# EAGLE design DoomBoxMk1 (EAGLE 9.6.2)
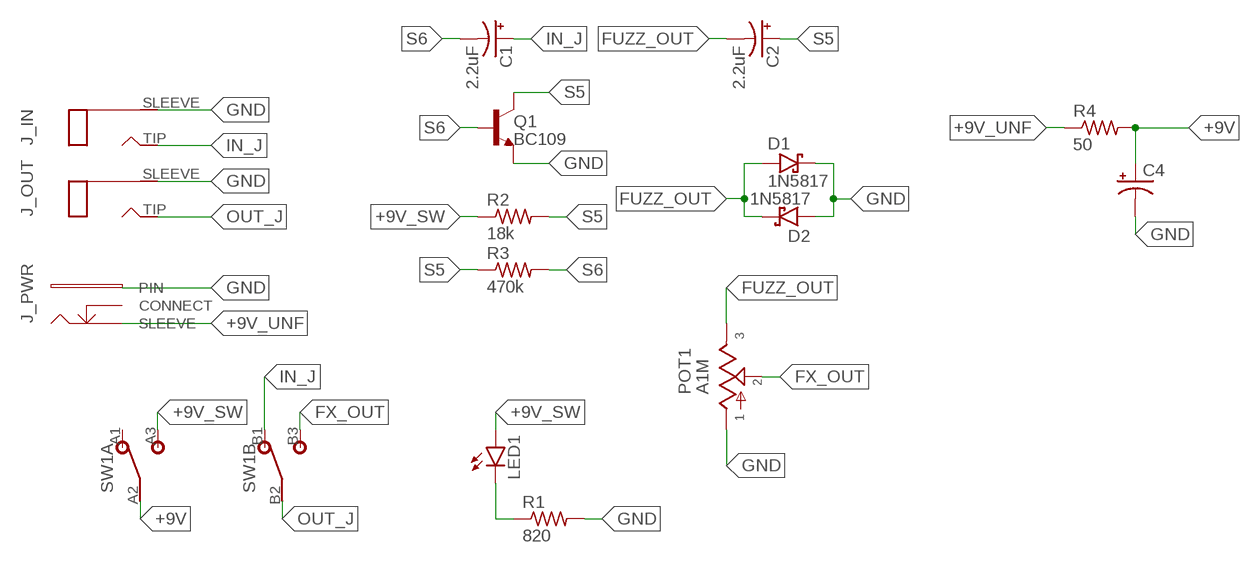
[diagram p0: schematic, sheet 1]

## Parts
C1  2.2uF  0501  [050_020_1]
C2  2.2uF  0501  [050_020_1]
C4  0802  [080_035_2]
D1  1N5817  [DO41-3]
D2  1N5817  [DO41-3]
J_IN  MONO  [MONO_JACK]
J_OUT  MONO  [MONO_JACK]
J_PWR  DC  [DC_POWER_JACK]
LED1  LED5MM  [LED5MM]
POT1  A1M  POTS  [16MM-SQUARE]
Q1  BC109  [TO92-]
R1  820  6MM.3  [R0207/3]
R2  18k  6MM.3  [R0207/3]
R3  470k  6MM.3  [R0207/3]
R4  50  6MM.3  [R0207/3]
SW1  DPDT  [DPDT]

## Nets
+9V: C4.+ R4.2 SW1.A2
+9V_SW: LED1.A R2.1 SW1.A3
+9V_UNF: J_PWR.SLEEVE R4.1
FUZZ_OUT: C2.- D1.A D2.C POT1.3
FX_OUT: POT1.2 SW1.B3
GND: C4.- D1.C D2.A J_IN.SLEEVE J_OUT.SLEEVE J_PWR.PIN POT1.1 Q1.1(E) R1.2
IN_J: C1.+ J_IN.TIP SW1.B1
N$2: LED1.K(C) R1.1
OUT_J: J_OUT.TIP SW1.B2
S5: C2.+ Q1.3(C) R2.2 R3.1
S6: C1.- Q1.2(B) R3.2
Unconnected: J_PWR.CLOSE(CONNECT) SW1.A1

## Library data of the parts
C1 C2 = gm-caps-electro-pol:050: 0.22 - 100uF Xicon values at Mouser.com: 10V: 10 - 100uF; 16V: 2.2 - 47uF; 25V: 0.47 - 47uF; 50V: 0.22 - 22uF
C4 = gm-caps-electro-pol:080: 47 - 470uF Xicon values at Mouser.com 10V: 330, 470uF; 16V: 220, 330uF; 25V: 220uF; 50V: 47, 100uF
D1 D2 = gm-diodes:1N5817
J_IN J_OUT = gm-jacks:MONO: Mono 1/4" Phone Jack
J_PWR = gm-jacks:DC: DC Jack
LED1 = led:LED: LED OSRAM: - CHIPLED LG R971, LG N971, LY N971, LG Q971, LY Q971, LO R971, LY R971 LH N974, LH R974 LS Q976, LO Q976, LY Q976 LO Q996 - Hyper CHIPLED LW Q18S LB Q993, LB Q99A, LB R99A - SideLED LS A670, LO A670, LY A670, LG A670, LP A670 LB A673, LV A673, LT A673, LW A673 LH A674 LY A675 LS A676, LA A676, LO A676, LY A676, LW A676 LS A679, LY A679, LG A679 - Hyper Micro SIDELED® LS Y876, LA Y876, LO Y876, LY Y876 LT Y87S - SmartLED LW L88C, LW L88S LB L89C, LB L89S, LG L890 LS L89K, LO L89K, LY L89K LS L896, LA L896, LO L896, LY L896 - TOPLED LS T670, LO T670, LY T670, LG T670, LP T670 LSG T670, LSP T670, LSY T670, LOP T670, LYG T670 LG T671, LOG T671, LSG T671 LB T673, LV T673, LT T673, LW T673 LH T674 LS T676, LA T676, LO T676, LY T676, LB T676, LH T676, LSB T676, LW T676 LB T67C, LV T67C, LT T67C, LS T67K, LO T67K, LY T67K, LW E67C LS E67B, LA E67B, LO E67B, LY E67B, LB E67C, LV E67C, LT E67C LW T67C LS T679, LY T679, LG T679 LS T770, LO T770, LY T770, LG T770, LP T770 LB T773, LV T773, LT T773, LW T773 LH T774 LS E675, LA E675, LY E675, LS T675 LS T776, LA T776, LO T776, LY T776, LB T776 LHGB T686 LT T68C, LB T68C - Hyper Mini TOPLED® LB M676 - Mini TOPLED Santana® LG M470 LS M47K, LO M47K, LY M47K Source: http://www.osram.convergy.de LUXEON: - LUMILED® LXK2-PW12-R00, LXK2-PW12-S00, LXK2-PW14-U00, LXK2-PW14-V00 LXK2-PM12-R00, LXK2-PM12-S00, LXK2-PM14-U00 LXK2-PE12-Q00, LXK2-PE12-R00, LXK2-PE12-S00, LXK2-PE14-T00, LXK2-PE14-U00 LXK2-PB12-K00, LXK2-PB12-L00, LXK2-PB12-M00, LXK2-PB14-N00, LXK2-PB14-P00, LXK2-PB14-Q00 LXK2-PR12-L00, LXK2-PR12-M00, LXK2-PR14-Q00, LXK2-PR14-R00 LXK2-PD12-Q00, LXK2-PD12-R00, LXK2-PD12-S00 LXK2-PH12-R00, LXK2-PH12-S00 LXK2-PL12-P00, LXK2-PL12-Q00, LXK2-PL12-R00 Source: www.luxeon.com KINGBRIGHT: KA-3528ASYC Source: www.kingbright.com
POT1 = gm-pots:POT: Potentiometers the arrow indicates the clockwise motion of th wiper (lug 2) fully counter clockwise there is no resistance between lugs 1 and 2 fully clockwise the resistance between lugs 1 and 2 is the value of the pot
Q1 = mb_trans:BC109
R1-R4 = gm-resistors:6MM: 6mm Resistors Leads spaced 1-6 holes apart for 0.1" perfboard. Suitable for 1/4 watt resistors.
SW1 = gm-switches:DPDT

## Net classes
0 default: width 0.61 mm, clearance 0.61 mm

## Board
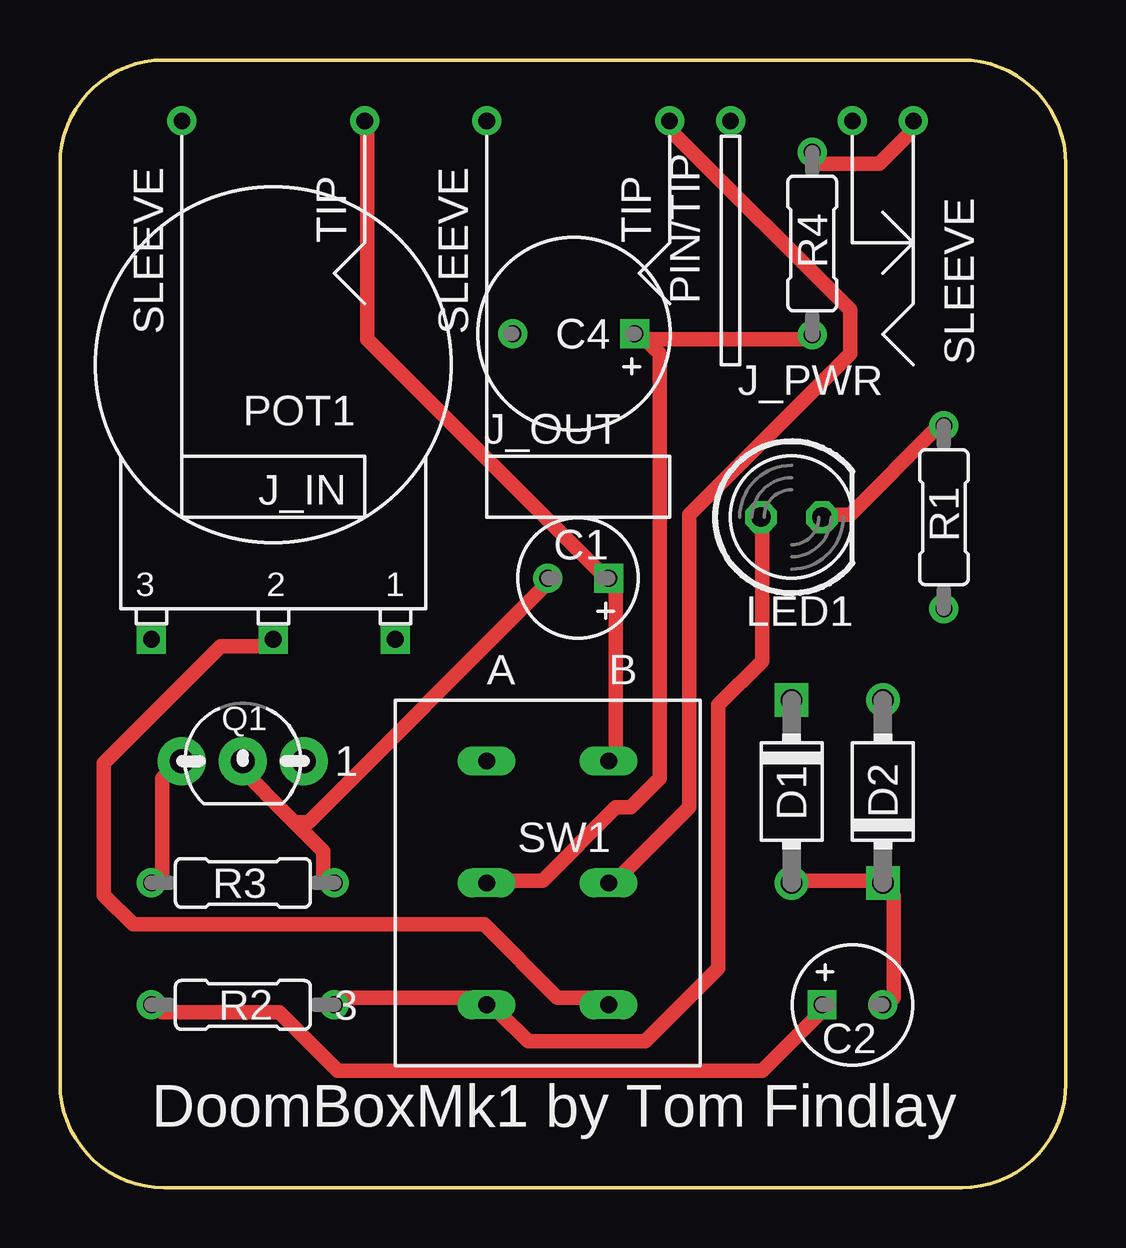
[diagram p1: board, top side]
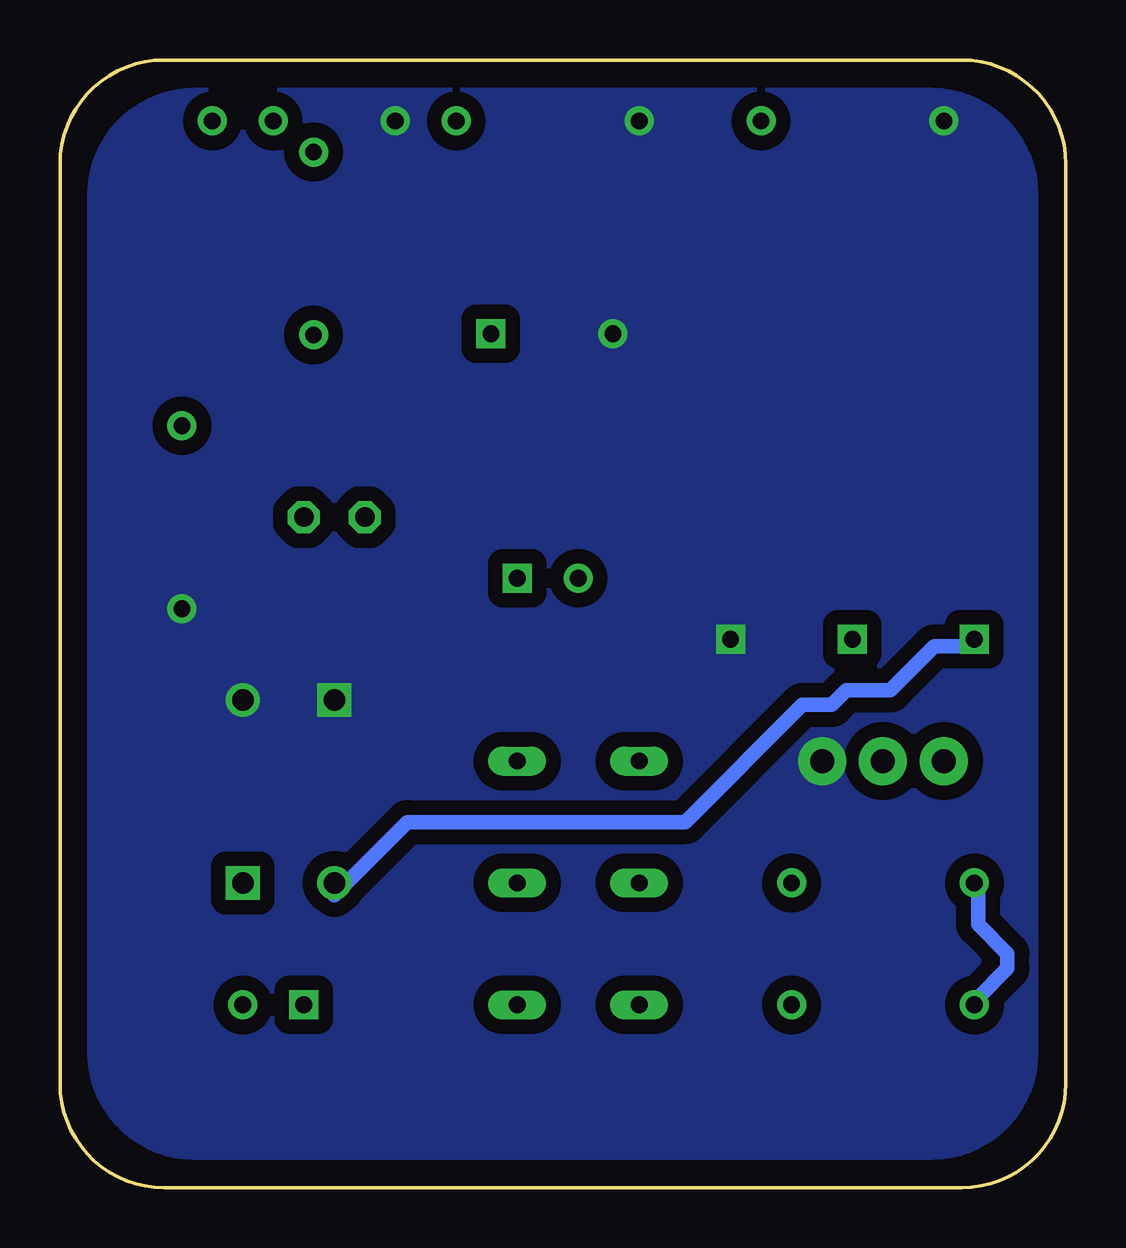
[diagram p2: board, bottom side, seen from below]

Size 41.91 x 46.99 mm. Coordinates in mm from the lower left corner, seen from the top.
Outline: 41.91,42.65 41.91,4.34 arc-90 37.57,0 4.34,0 arc-90 0,4.34 0,42.65 arc-90 4.34,46.99 37.57,46.99 arc-90 41.91,42.65
Copper layers (1*16): Top 0.035mm / dielectric 1.5mm / Bottom 0.035mm
Design rules "default": minimum track width 6mil, minimum drill 0.35mm, track to track 6mil, track to pad 6mil, pad to pad 6mil, via to via 6mil, smd to smd 6mil, copper to edge 40mil, drill to drill 6mil, minimum pad ring 10mil, minimum via ring 8mil, stop-mask expansion 4mil, vias tented up to drill 0mil, thermal gap 10mil

### Footprints (pad centres in the part's own frame; a part is rotated, then mirrored left to right if it is on the bottom)
050_020_1 = drill 0.7 square: + -1.27,0 | drill 0.7: - 1.27,0
080_035_2 = drill 0.7 square: + -2.54,0 | drill 0.7: - 2.54,0
DO41-3 = drill 0.9: A 3.81,0 | drill 0.9 square: C -3.81,0
MONO_JACK = drill 0.7: SLEEVE -7.62,-3.81; TIP -7.62,3.81
DC_POWER_JACK = drill 0.7: CLOSE 7.62,-2.54; PIN 7.62,2.54; SLEEVE 7.62,-5.08
LED5MM = drill 0.813 octagon: A -1.27,0; K 1.27,0
16MM-SQUARE = drill 0.7 square: 1 5.08,0; 2 0,0; 3 -5.08,0
TO92- = drill 1 pad 2: 1 2.54,0; 2 0,0; 3 -2.54,0
R0207/3 = drill 0.7: 1 -3.81,0; 2 3.81,0
DPDT = drill 0.7 long: A1 -2.54,5.08; A2 -2.54,0; A3 -2.54,-5.08; B1 2.54,5.08; B2 2.54,0; B3 2.54,-5.08

### Placement (x,y rotation side)
C1  21.59,25.4 180 top
C2  33.02,7.62 0 top
C4  21.41,35.59 180 top
D1  30.48,16.51 270 top
D2  34.29,16.51 90 top
J_IN  8.89,36.83 270 top
J_OUT  21.59,36.83 270 top
J_PWR  30.48,36.83 90 top
LED1  30.48,27.94 0 top
POT1  8.89,22.86 0 top
Q1  7.62,17.78 0 top
R1  36.83,27.94 270 top
R2  7.62,7.62 180 top
R3  7.62,12.7 0 top
R4  31.34,39.34 270 top
SW1  20.32,12.7 0 top

### Tracks (layer width: path | path; a pad name or v marks a point on that pad's centre or on a via)
+9V
  Top 0.61: 24.38,35.36 24.99,34.75 24.99,17.07 23.77,15.85 23.16,15.85 20.12,12.8 18.29,12.8 SW1.A2 | 24.38,35.36 31.09,35.36 R4.2 | 24.38,35.36 C4.+
+9V_SW
  Top 0.61: R2.1 11.58,7.92 17.68,7.92 SW1.A3 18.29,7.32 19.51,6.1 24.38,6.1 27.43,9.14 27.43,20.12 29.26,21.95 29.26,27.43 LED1.A
+9V_UNF
  Top 0.61: R4.1 31.7,42.67 34.14,42.67 35.36,43.89 J_PWR.SLEEVE
FUZZ_OUT
  Top 0.61: C2.- 34.75,7.92 34.75,12.19 D2.C 34.14,12.8 30.48,12.8 D1.A
  Bottom 0.61: POT1.3 4.27,22.55 5.49,22.55 7.32,20.73 9.14,20.73 9.75,20.12 10.97,20.12 15.85,15.24 27.43,15.24 30.48,12.19 D1.A
FX_OUT
  Top 0.61: SW1.B3 22.55,7.92 20.73,7.92 17.68,10.97 3.05,10.97 1.83,12.19 1.83,17.68 6.71,22.55 8.53,22.55 POT1.2
GND
  pour Bottom (isolate 0.254, no thermals): 1.27,41.38 1.27,5.61 arc90 5.61,1.27 36.3,1.27 arc90 40.64,5.61 40.64,41.38 arc90 36.3,45.72 5.61,45.72 arc90
IN_J
  Top 0.61: SW1.B1 23.16,18.29 23.16,24.99 C1.+ 22.55,25.6 12.8,35.36 12.8,43.89 J_IN.TIP
N$2
  Top 0.61: R1.1 36.58,31.7 32.92,28.04 32.31,28.04 LED1.K
OUT_J
  Top 0.61: SW1.B2 23.16,12.8 26.21,15.85 26.21,28.04 32.92,34.75 32.92,36.58 25.6,43.89 J_OUT.TIP
S5
  Top 0.61: R3.1 4.27,12.8 4.27,17.07 4.88,17.68 Q1.3 | R2.2 4.27,7.32 9.14,7.32 11.58,4.88 29.26,4.88 31.7,7.32 C2.+
  Bottom 0.61: R3.1 3.66,12.19 3.66,10.97 2.44,9.75 2.44,9.14 3.66,7.92 R2.2
S6
  Top 0.61: 9.75,15.24 7.32,17.68 Q1.2 | 9.75,15.24 10.97,14.02 10.97,12.8 R3.2 | 9.75,15.24 10.36,15.24 20.12,24.99 C1.-

### Text on the board
tNames: DoomBoxMk1 by Tom Findlay